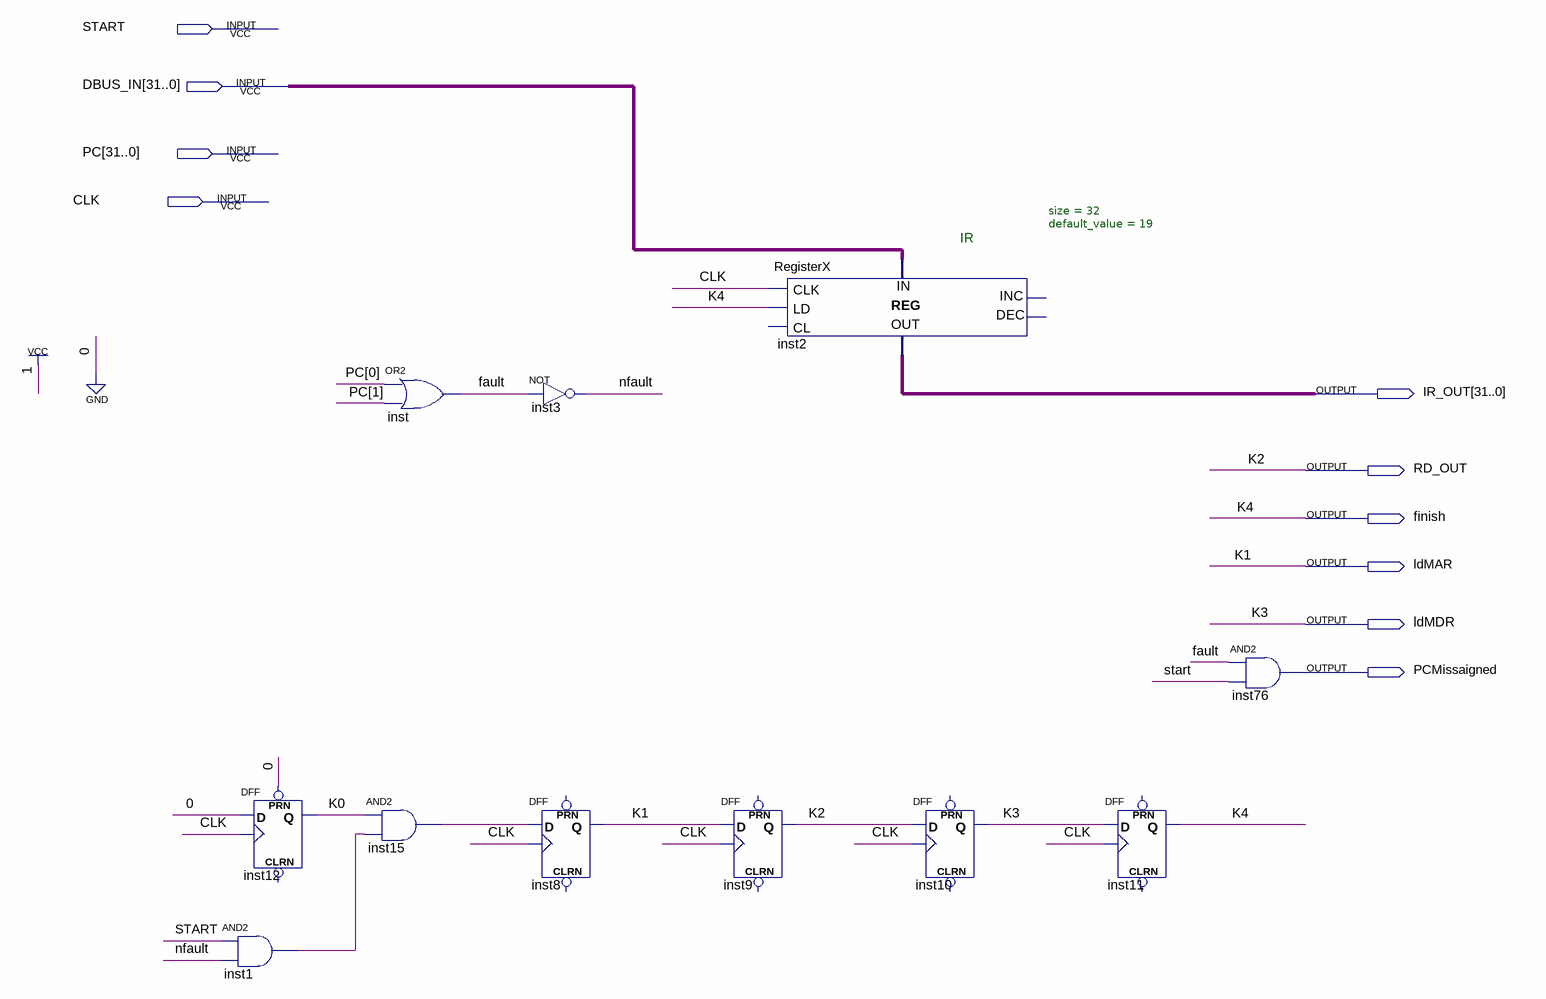
[diagram p0: schematic sheet]
// Quartus schematic FetchFaza.bdf as structural Verilog: 11 symbols, 10 pins
module FetchFaza (
  input  START,
  input  [31:0] DBUS_IN,
  input  [31:0] PC,
  input  CLK,
  output [31:0] IR_OUT,
  output RD_OUT,
  output finish,
  output ldMAR,
  output ldMDR,
  output PCMissaigned
);

  wire fault, inst1_out, inst15_out, K0, nfault;

  DFF inst12 (.CLK(CLK), .D(1'b0), .PRN(1'b0), .Q(K0));  // open: CLRN
  and inst1 (inst1_out, START, nfault);
  or inst (fault, PC[0], PC[1]);
  and inst15 (inst15_out, K0, inst1_out);
  not inst3 (nfault, fault);
  DFF inst8 (.CLK(CLK), .D(inst15_out), .Q(ldMAR));  // open: CLRN, PRN
  RegisterX #(.size(32), .default_value(19)) inst2 (
    .CLK(CLK), .LD(finish), .DATA_IN(DBUS_IN), .DATA_OUT(IR_OUT));  // open: CL, INC, DEC
  DFF inst9 (.CLK(CLK), .D(ldMAR), .Q(RD_OUT));  // open: CLRN, PRN
  DFF inst10 (.CLK(CLK), .D(RD_OUT), .Q(ldMDR));  // open: CLRN, PRN
  DFF inst11 (.CLK(CLK), .D(ldMDR), .Q(finish));  // open: CLRN, PRN
  and inst76 (PCMissaigned, fault, START);

  // Other names for the same wires on the sheet: K1 = ldMAR; K2 = RD_OUT; K3 = ldMDR; K4 = finish

  // Notes on the sheet:
  //   IR
endmodule
